# EAGLE schematic audio-ext (EAGLE 9.6.2)
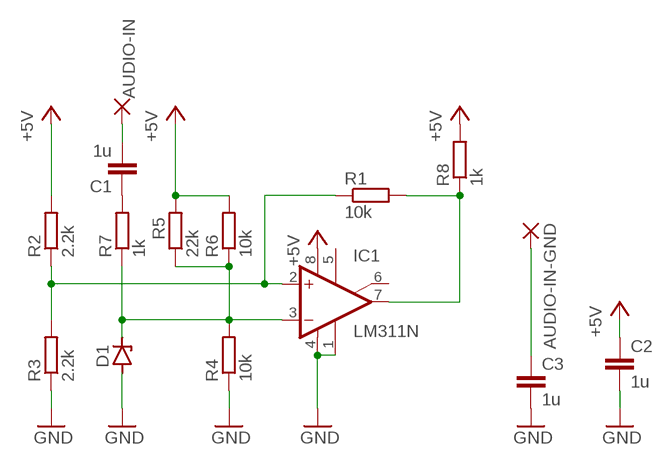
[diagram p0: schematic, sheet 1]

## Parts
AUDIO-IN  WIREPAD1,6/0,8  [1,6/0,8]
AUDIO-IN-GND  WIREPAD1,6/0,8  [1,6/0,8]
C1  1u  C-EUC0805  [C0805]
C2  1u  C-EUC0805  [C0805]
C3  1u  C-EUC0805  [C0805]
D1  ZENER-DIODESOT23  [SOT23]
IC1  LM311N  [DIL08]
R1  10k  R-EU_R0805  [R0805]
R2  2.2k  R-EU_R0805  [R0805]
R3  2.2k  R-EU_R0805  [R0805]
R4  10k  R-EU_R0805  [R0805]
R5  22k  R-EU_R0805  [R0805]
R6  10k  R-EU_R0805  [R0805]
R7  1k  R-EU_R0805  [R0805]
R8  1k  R-EU_R0805  [R0805]

## Nets
+5V: C2.1 IC1.8(V+) R2.2 R5.2 R6.2 R8.2
GND: C2.2 C3.2 D1.1(A) IC1.1(GND) IC1.4(V-) R3.1 R4.1
N$1: AUDIO-IN.1(P) C1.2
N$2: AUDIO-IN-GND.1(P) C3.1
N$3: C1.1 R7.2
N$4: IC1.7(OUT) R1.2 R8.1
N$5: IC1.2(+IN) R1.1 R2.1 R3.2
N$6: D1.3(C) IC1.3(-IN) R4.2 R5.1 R6.1 R7.1
Unconnected: IC1.5(ON) IC1.6(ON/STR)

## Library data of the parts
AUDIO-IN AUDIO-IN-GND = wirepad:WIREPAD: Wire PAD connect wire on PCB
C1-C3 = rcl:C-EU: CAPACITOR, European symbol; SPICEPREFIX: C
D1 = diode:ZENER-DIODE: Z-Diode
IC1 = linear:LM311: COMPARATOR
R1-R8 = rcl:R-EU_: RESISTOR, European symbol; SPICEPREFIX: R